# EAGLE design FT232-Breakout-v10 (EAGLE 6.4)
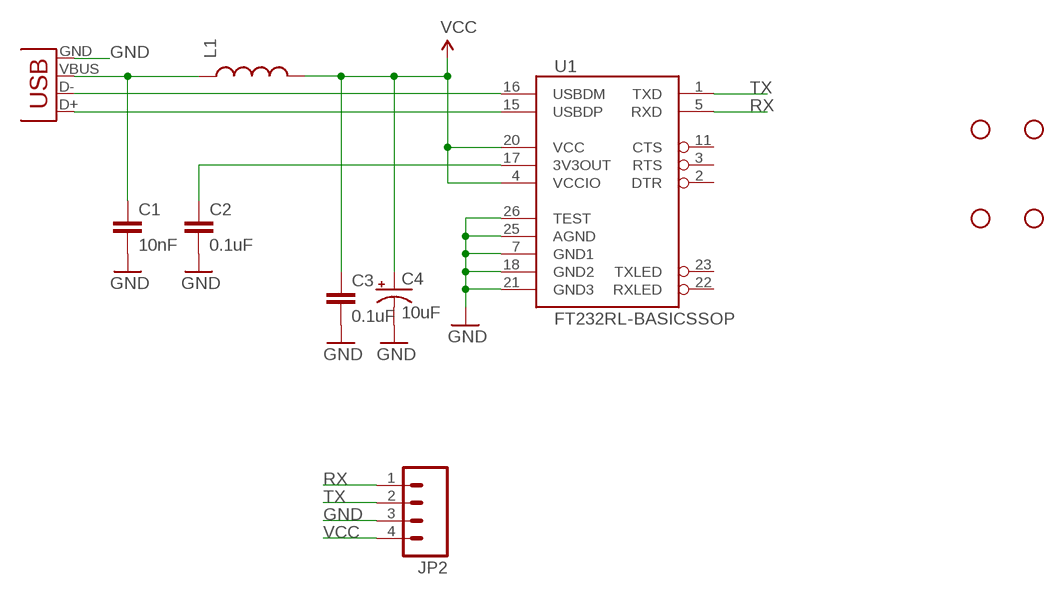
[diagram p0: schematic, sheet 1]

## Parts
C1  10nF  CAP0603-CAP  [0603-CAP]
C2  0.1uF  CAP0603-CAP  [0603-CAP]
C3  0.1uF  CAP0603-CAP  [0603-CAP]
C4  10uF  CAP_POL1206  [EIA3216]
JP1  USB-B  USBPTH  [USB-B-PTH]
JP2  M04PTH  [1X04]
L1  INDUCTOR0603  [0603]
STANDOFF1  STAND-OFF  [STAND-OFF]
STANDOFF2  STAND-OFF  [STAND-OFF]
STANDOFF3  STAND-OFF  [STAND-OFF]
STANDOFF4  STAND-OFF  [STAND-OFF]
U1  FT232RL-BASICSSOP  [SSOP28DB]

## Nets
GND: C1.2 C2.2 C3.2 C4.C(-) JP1.GND JP2.3 U1.7(GND1) U1.18(GND2) U1.21(GND3) U1.25(AGND) U1.26(TEST)
N$1: C1.1 JP1.VBUS L1.1
N$2: C2.1 U1.17(3V3OUT)
N$3: JP1.D- U1.16(USBDM)
N$4: JP1.D+ U1.15(USBDP)
RX: JP2.1 U1.5(RXD)
TX: JP2.2 U1.1(TXD)
VCC: C3.1 C4.A(+) JP2.4 L1.2 U1.4(VCCIO) U1.20(VCC)
Unconnected: U1.2(DTR) U1.3(RTS) U1.11(CTS) U1.22(RXLED) U1.23(TXLED)

## Library data of the parts
C1-C3 = SparkFun-Capacitors:CAP: Capacitor Standard 0603 ceramic capacitor, and 0.1" leaded capacitor.
C4 = SparkFun-Capacitors:CAP_POL: Capacitor Polarized These are standard SMD and PTH capacitors. Normally 10uF, 47uF, and 100uF in electrolytic and tantalum varieties. Always verify the external diameter of the through hole cap, it varies with capacity, voltage, and manufacturer. The EIA devices should be standard.
JP1 = SparkFun-Connectors:USB: USB Connectors USB-B-PTH is fully proven SKU : PRT-00139/CONN-08278 USB-miniB is fully proven SKU : PRT-00587 USB-A-PCB is untested. USB-A-H is throughly reviewed, but untested. Spark Fun Electronics SKU : PRT-00437 USB-B-SMT is throughly reviewed, but untested. Needs silkscreen touching up. USB-A-S has not been used/tested USB-MB-H has not been used/tested USB-MICROB has been used. CONN-09505; PROD_ID: CONN-08278
JP2 = SparkFun-Connectors:M04: Header 4 Standard 4-pin 0.1" header. Use with straight break away headers (SKU : PRT-00116), right angle break away headers (PRT-00553), swiss pins (PRT-00743), machine pins (PRT-00117), and female headers (PRT-00115). Molex polarized connector foot print use with SKU : PRT-08231 with associated crimp pins and housings. 1MM SMD Version SKU: PRT-10208
L1 = SparkFun-Passives:INDUCTOR: Inductors Basic Inductor/Choke - 0603 and 1206. Footprints are not proven and vary greatly between part numbers.
STANDOFF1-STANDOFF4 = SparkFun-Electromechanical:STAND-OFF: #4 Stand Off This is the mechanical footprint for a #4 phillips button head screw. Use the keepout ring to avoid running the screw head into surrounding components. SKU : PRT-00447
U1 = SparkFun-DigitalIC:FT232RL-BASIC: USB UART This is the simplified version of the FT232RL unit. Only what you need, nothing you don't. Spark Fun Electronics SKU : COM-00650

## Board
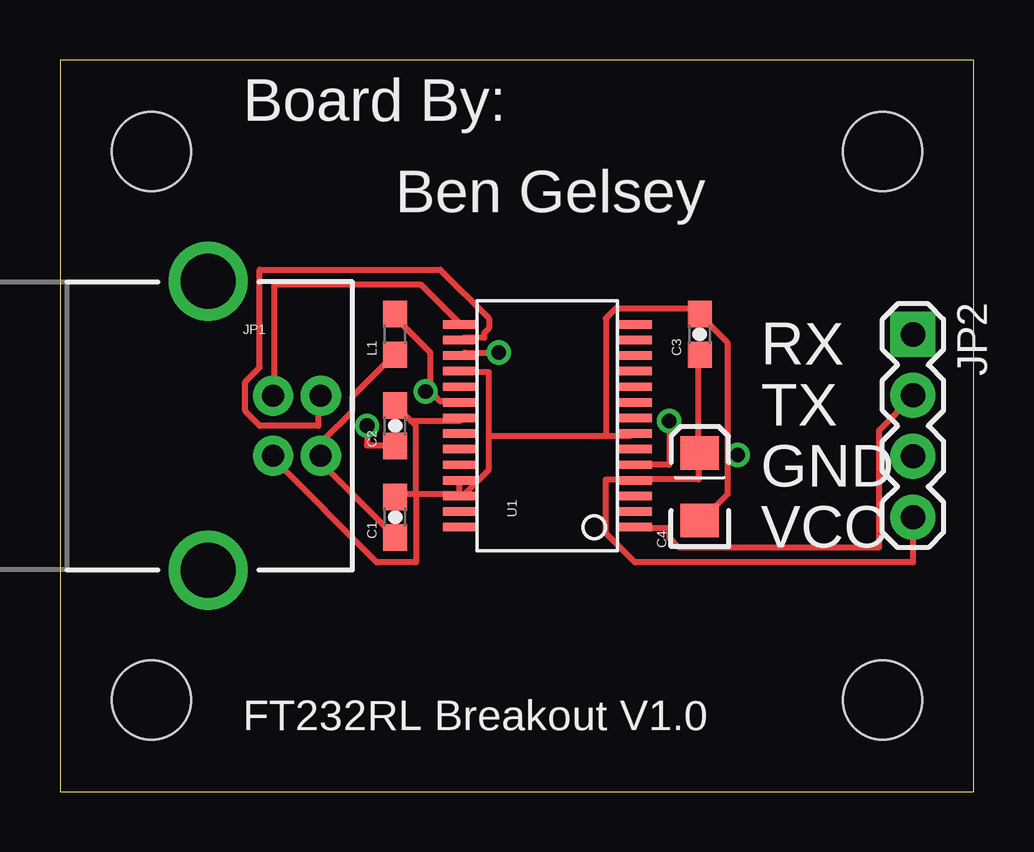
[diagram p1: board, top side]
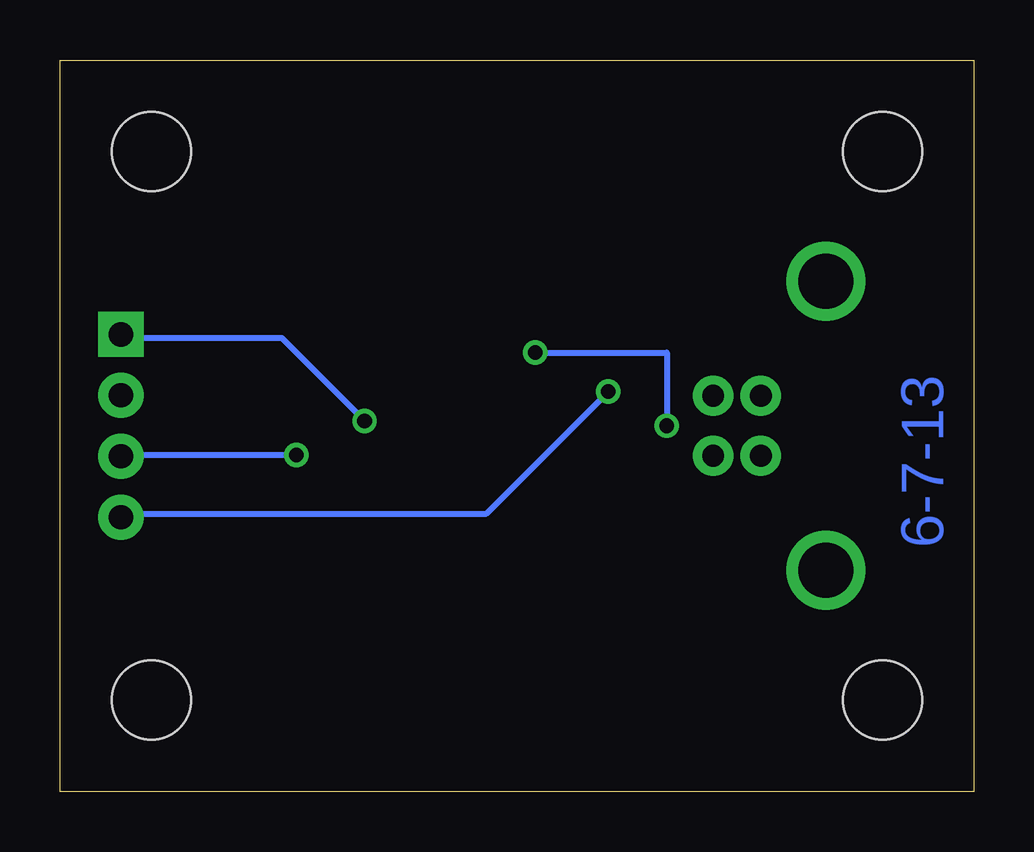
[diagram p2: board, bottom side, seen from below]

Size 38.1 x 30.48 mm. Coordinates in mm from the lower left corner, seen from the top.
Outline: 0,0 38.1,0 38.1,30.48 0,30.48 0,0
Copper layers (1*16): Top 0.035mm / dielectric 1.5mm / Bottom 0.035mm
Design rules "default": minimum track width 10mil, minimum drill 24mil, track to track 8mil, track to pad 8mil, pad to pad 8mil, via to via 8mil, smd to smd 8mil, copper to edge 40mil, drill to drill 8mil, minimum pad ring 10mil, minimum via ring 8mil, stop-mask expansion 4mil, vias tented up to drill 0mil, thermal gap 10mil

### Footprints (pad centres in the part's own frame; a part is rotated, then mirrored left to right if it is on the bottom)
0603-CAP = smd 1.1 x 1: 1 -0.85,0; 2 0.85,0
EIA3216 = smd 1.4 x 1.6: A 1.4,0; C -1.4,0
USB-B-PTH = drill 0.914 pad 1.676: D+ 0,1.25; D- 1.981,1.25; GND 0,-1.25; VBUS 1.981,-1.25 | drill 2.286: S1 -2.718,-6.02; S2 -2.718,6.02
1X04 = drill 1.016 pad 1.88 square: 1 0,0 | drill 1.016 pad 1.88: 2 2.54,0; 3 5.08,0; 4 7.62,0
0603 = smd 1.1 x 1: 1 -0.85,0; 2 0.85,0
STAND-OFF = hole 3.302: 0,0
SSOP28DB = smd 0.348 x 1.397: 1 -4.225,-3.656; 2 -3.575,-3.656; 3 -2.925,-3.656; 4 -2.275,-3.656; 5 -1.625,-3.656; 6 -0.975,-3.656; 7 -0.325,-3.656; 8 0.325,-3.656; 9 0.975,-3.656; 10 1.625,-3.656; 11 2.275,-3.656; 12 2.925,-3.656; 13 3.575,-3.656; 14 4.225,-3.656; 15 4.225,3.656; 16 3.575,3.656; 17 2.925,3.656; 18 2.275,3.656; 19 1.625,3.656; 20 0.975,3.656; 21 0.325,3.656; 22 -0.325,3.656; 23 -0.975,3.656; 24 -1.625,3.656; 25 -2.275,3.656; 26 -2.925,3.656; 27 -3.575,3.656; 28 -4.225,3.656

### Placement (x,y rotation side)
C1  13.97,11.43 90 top
C2  13.97,15.24 90 top
C3  26.67,19.05 90 top
C4  26.67,12.7 90 top
JP1  8.89,15.24 0 top
JP2  35.56,19.05 270 top
L1  13.97,19.05 90 top
STANDOFF1  34.29,3.81 0 top
STANDOFF2  3.81,3.81 0 top
STANDOFF3  34.29,26.67 0 top
STANDOFF4  3.81,26.67 0 top
U1  20.32,15.24 90 top

### Tracks (layer width: path | path; a pad name or v marks a point on that pad's centre or on a via)
GND  (via drill 0.61)
  Top 0.254: 16.66,12.39 14.83,12.39 | 14.83,12.39 14.02,12.39 C1.2 | 14.63,15.44 14.83,15.24 14.83,12.39 | 14.63,15.44 14.02,16.05 C2.2 | 16.66,12.39 16.66,12.8 U1.25 | 16.66,12.39 U1.26 16.87,12.39 17.88,13.41 17.88,14.83 | 14.63,15.44 16.66,15.44 U1.21 | 17.88,14.83 22.76,14.83 | 22.76,14.83 23.77,14.83 U1.7 | 17.88,14.83 17.88,17.48 16.87,17.48 U1.18 | 27.84,14.02 27.84,12.39 26.82,11.38 C4.C | 27.84,14.02 27.84,18.69 26.82,19.71 C3.2 26.62,19.91 26.62,20.12 23.16,20.12 22.76,19.71 22.76,14.83 | 27.84,14.02 v28.25,14.02 | 14.83,12.39 14.83,9.55 13.21,9.55 8.94,13.82 JP1.GND
  Bottom 0.254: v28.25,14.02 35.56,14.02 JP2.3
N$1
  Top 0.254: C1.1 13.82,10.77 10.97,13.61 10.97,13.82 JP1.VBUS 10.97,14.02 10.97,14.63 12.19,15.85 12.19,16.46 13.82,18.09 L1.1
N$2  (via drill 0.61)
  Top 0.254: v12.8,15.24 12.8,14.43 13.82,14.43 C2.1 | v18.29,18.29 16.87,18.29 U1.17
  Bottom 0.254: v12.8,15.24 12.8,18.29 v18.29,18.29
N$3
  Top 0.254: U1.16 16.87,18.9 17.68,18.9 17.68,19.1 17.88,19.3 17.88,19.71 15.85,21.74 8.33,21.74 8.33,17.68 7.72,17.07 7.72,15.85 8.33,15.24 10.77,15.24 10.77,16.46 JP1.D-
N$4
  Top 0.254: U1.15 16.66,19.51 15.04,21.13 8.94,21.13 8.94,16.66 JP1.D+
RX  (via drill 0.61)
  Top 0.254: v25.4,15.44 25.4,13.61 U1.5
  Bottom 0.254: v25.4,15.44 28.85,18.9 35.56,18.9 JP2.1
TX
  Top 0.254: U1.1 23.98,10.97 25.4,10.97 25.4,10.57 25.81,10.16 34.14,10.16 34.14,15.04 35.56,16.46 JP2.2
VCC  (via drill 0.61)
  Top 0.254: C3.1 26.62,18.09 26.62,14.22 C4.A 26.62,14.02 26.62,13.01 23.98,13.01 U1.4 23.77,13.01 22.76,13.01 22.76,10.77 23.98,9.55 35.56,9.55 JP2.4 | 15.44,16.66 15.44,18.29 14.02,19.71 L1.2 | 15.44,16.66 15.85,16.26 16.66,16.26 U1.20 | v15.24,16.66 15.44,16.66
  Bottom 0.254: v15.24,16.66 20.32,11.58 35.56,11.58 JP2.4

### Text on the board
Bottom: 6-7-13
tPlace: Board By: | Ben Gelsey | RX | TX | GND | VCC | FT232RL Breakout V1.0